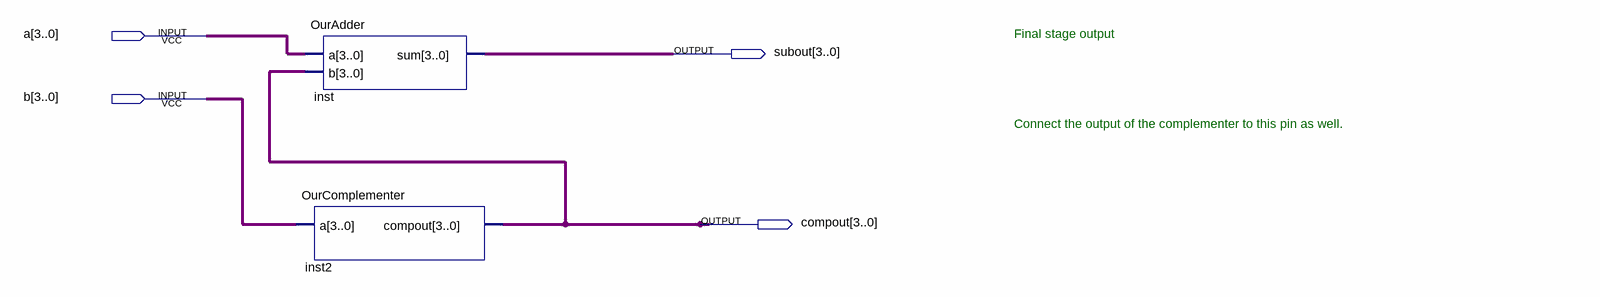
[diagram p0: schematic sheet]
// Quartus schematic OurSubtractor.bdf as structural Verilog: 2 symbols, 4 pins
module OurSubtractor (
  input  [3:0] a,
  input  [3:0] b,
  output [3:0] subout,
  output [3:0] compout
);

  OurComplementer inst2 (.a(b), .compout(compout));
  OurAdder inst (.a(a), .b(compout), .sum(subout));

  // Notes on the sheet:
  //   Final stage output
  //   Connect the output of the complementer to this pin as well.
endmodule
